# Altium schematic sheet Real Time Clock.SchDoc
size A4; Organization: TESLA Motors, INC; Address1: 3500 Deer Creek Road; Address2: Palo Alto, CA; Address4: U.S.A.; SheetNumber: 13; SheetTotal: 21
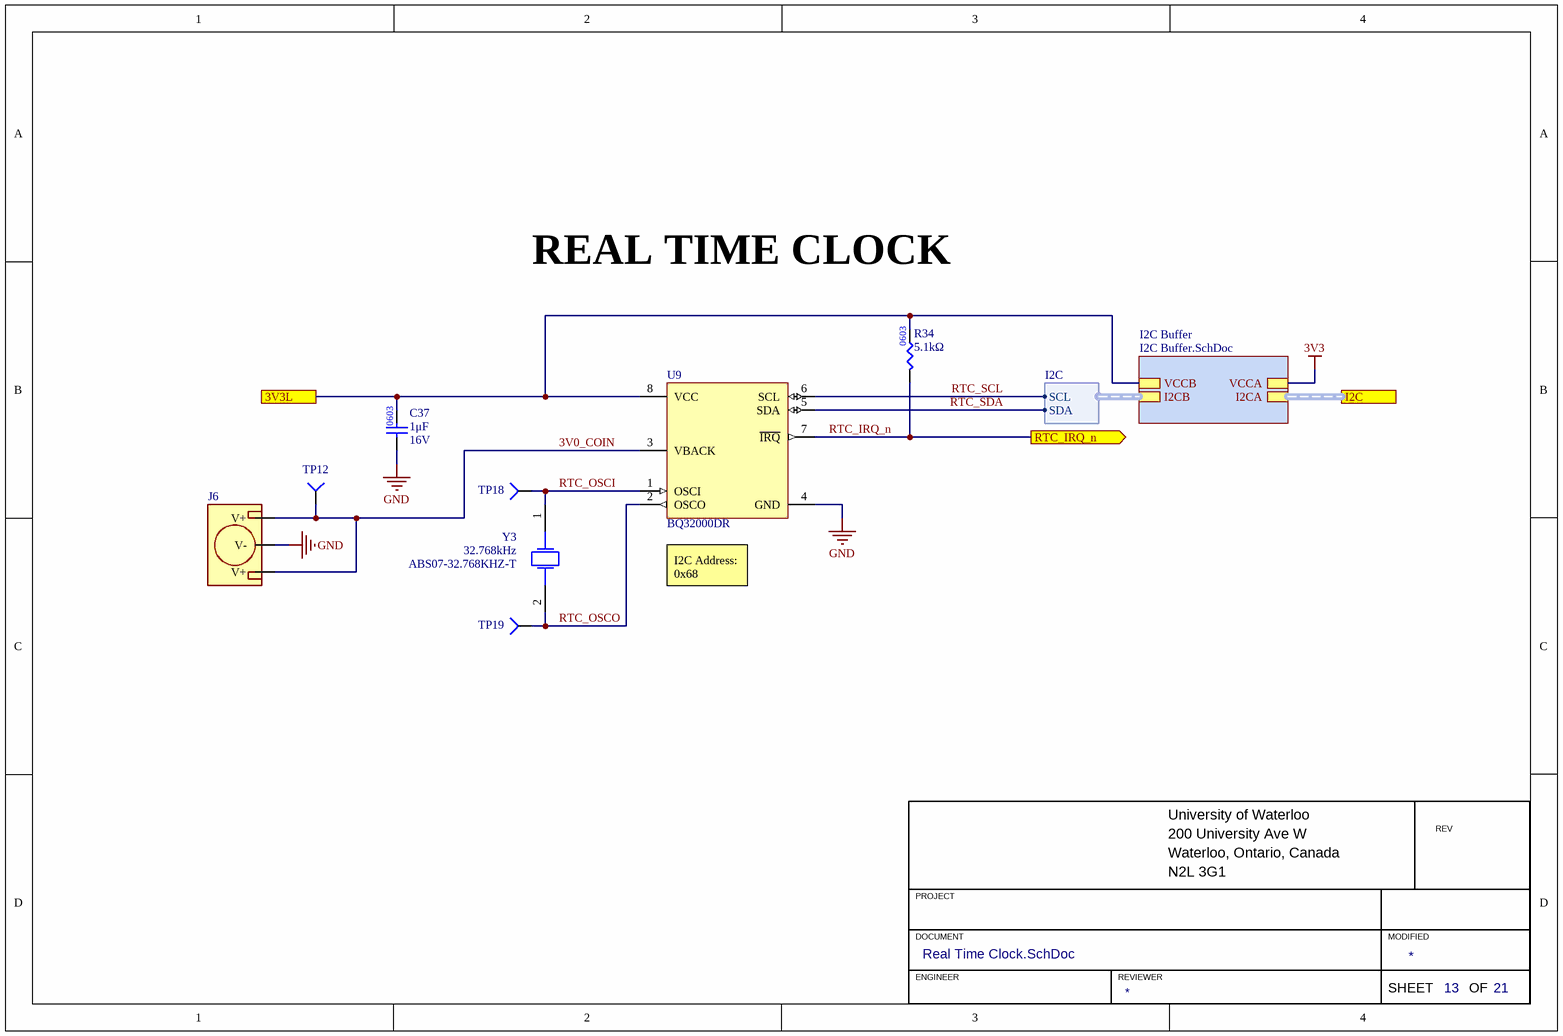
[diagram p0: Real Time Clock.SchDoc]

## Parts
C37  value 1μF  Voltage Rating: 16V  [CAP0603]  (hidden comment: CAP_1uF_16V_0603)
J6  CON_2POS_CR1220  [ATECH_COIN_12MM]  (value not drawn)
R34  value 5.1kΩ  [RES0603]  (hidden comment: RES_5.1kΩ_0603_1%)
TP12  TESTPOINT_1MM_CIRCLE  [TESTPOINT_CIRCLE_1MM]  (value not drawn)  (no BOM)
TP18  TESTPOINT_1MM_CIRCLE  [TESTPOINT_CIRCLE_1MM]  (value not drawn)  (no BOM)
TP19  TESTPOINT_1MM_CIRCLE  [TESTPOINT_CIRCLE_1MM]  (value not drawn)  (no BOM)
U9  BQ32000DR  [TI_8-SOIC]
Y3  Frequency: 32.768kHz  Manufacturer Part Number 1: ABS07-32.768KHZ-T  [OSC_ABS07]  (hidden comment: CRYSTAL_32.768KHZ_ABRACON)

## Sub-sheets
I2C Buffer = I2C Buffer.SchDoc: I2CA (harness I2C), I2CB (harness I2C), VCCA, VCCB

## Ports
3V3L, I2C (harness I2C), RTC_IRQ_n (out)

## Harnesses
I2C: SDA, SCL

## Nets
3V3: sheet I2C Buffer/VCCA
GND: C37.1 J6.2(V-) U9.4(GND)
3V0_COIN: J6.1(V+) TP12.1(=value) U9.3(VBACK)
3V3L: C37.2 R34.2 U9.8(VCC) ; port 3V3L, sheet I2C Buffer/VCCB
RTC_IRQ_n: R34.1 U9.7(~{IRQ}) ; port RTC_IRQ_n
RTC_OSCI: TP18.1(=value) U9.1(OSCI) Y3.1
RTC_OSCO: TP19.1(=value) U9.2(OSCO) Y3.2
RTC_SCL: U9.6(SCL) ; sheet I2C Buffer/I2CB.SCL
RTC_SDA: U9.5(SDA) ; sheet I2C Buffer/I2CB.SDA

## Buses and harness runs
harness port I2C = sheet I2C Buffer/I2CA

## Notes on the sheet
- REAL TIME CLOCK
- (near U9) I2C Address:
  0x68
- University of Waterloo
- 200 University Ave W
- REV
- PROJECT
- Waterloo, Ontario, Canada
- N2L 3G1
- DOCUMENT
- ENGINEER
- REVIEWER
- MODIFIED
- SHEET
- OF

## Library data of the parts
C37 = CAP_1uF_16V_0603: CAP CER 1UF 16V X7R 0603; Manufacturer 1: Yageo; Manufacturer Part Number 1: CC0603KPX7R7BB105; Supplier Part Number 1: 13-CC0603KPX7R7BB105CT-ND; Supplier 1: Digi-Key; Mounting Type: SMD; Package: 0603; Dielectric: X7R
J6 = CON_2POS_CR1220: BATTERY RETAINER COIN 12MM SMD; Manufacturer 1: Adam Tech; Manufacturer Part Number 1: BH-122A-5; Mounting Type: SMD; Supplier 1: Digi-Key; Supplier Part Number 1: 2057-BH-122A-5-ND
R34 = RES_5.1kΩ_0603_1%: RES 5.1K OHM 1% 1/10W 0603; Manufacturer 1: YAGEO; Manufacturer Part Number 1: RC0603FR-135K1L; Mounting Type: SMD; Package: 0603; Supplier 1: Digi-Key; Supplier Part Number 1: 13-RC0603FR-135K1LCT-ND
TP12 TP18 TP19 = TESTPOINT_1MM_CIRCLE: TESTPOINT 1MM CIRCLE
U9 = BQ32000DR: IC RTC CLK/CALENDAR I2C 8SOIC; Manufacturer 1: Texas Instruments; Package/Footprint: 8-SOIC; Supplier 1: Digi-Key; Supplier Part Number 1: 296-24583-1-ND; Manufacturer Part Number 1: BQ32000DR
Y3 = CRYSTAL_32.768KHZ_ABRACON: CRYSTAL 32.7680KHZ 12.5PF SMD; Manufacturer 1: Abracon LLC; Supplier 1: Digi-Key; Supplier Part Number 1: 535-9542-1-ND